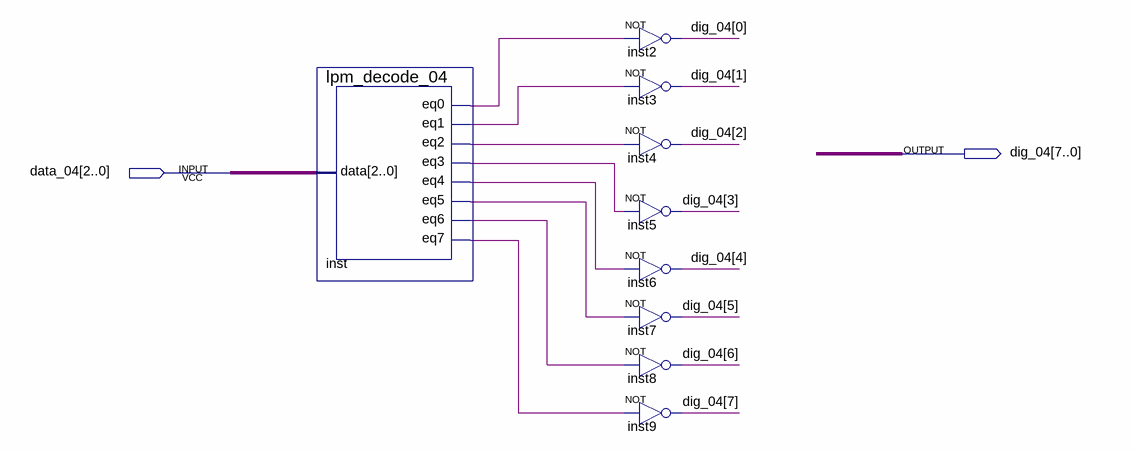
[diagram p0: schematic sheet]
// Quartus schematic dig_select_04.bdf as structural Verilog: 9 symbols, 2 pins
module dig_select_04 (
  input  [2:0] data_04,
  output [7:0] dig_04
);

  wire inst_eq0, inst_eq1, inst_eq2, inst_eq3, inst_eq4, inst_eq5, inst_eq6, inst_eq7;

  lpm_decode_04 inst (
    .data(data_04), .eq0(inst_eq0), .eq1(inst_eq1), .eq2(inst_eq2), .eq3(inst_eq3), .eq4(inst_eq4),
    .eq5(inst_eq5), .eq6(inst_eq6), .eq7(inst_eq7));
  not inst2 (dig_04[0], inst_eq0);
  not inst3 (dig_04[1], inst_eq1);
  not inst4 (dig_04[2], inst_eq2);
  not inst5 (dig_04[3], inst_eq3);
  not inst6 (dig_04[4], inst_eq4);
  not inst7 (dig_04[5], inst_eq5);
  not inst8 (dig_04[6], inst_eq6);
  not inst9 (dig_04[7], inst_eq7);
endmodule
